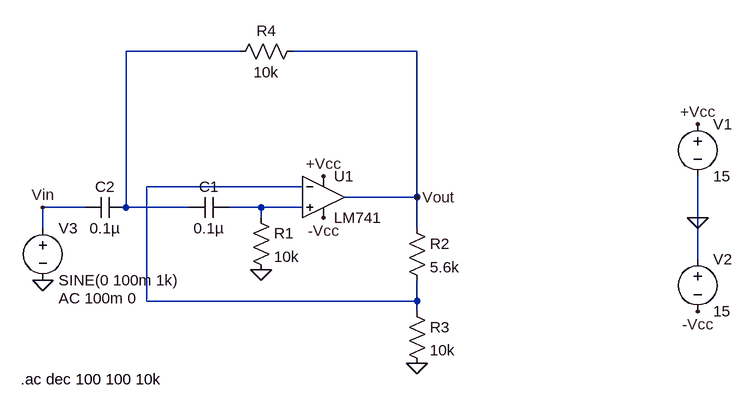
[diagram p0: schematic HPF.asc]
HPF.asc, the LTspice schematic file:
Version 4
SHEET 1 880 680
WIRE -256 -96 -432 -96
WIRE 16 -96 -176 -96
WIRE -160 112 -400 112
WIRE 16 128 16 -96
WIRE 16 128 -96 128
WIRE -496 144 -560 144
WIRE -432 144 -432 -96
WIRE -336 144 -432 144
WIRE -224 144 -272 144
WIRE -160 144 -224 144
WIRE -224 160 -224 144
WIRE 448 160 448 96
WIRE -560 176 -560 144
WIRE 16 176 16 128
WIRE 448 224 448 160
WIRE -400 288 -400 112
WIRE 16 288 16 256
WIRE 16 288 -400 288
WIRE 16 304 16 288
FLAG 448 160 0
FLAG 448 16 +Vcc
FLAG 448 304 -Vcc
FLAG -224 240 0
FLAG 16 384 0
FLAG -128 96 +Vcc
FLAG -128 160 -Vcc
FLAG 16 128 Vout
FLAG -560 256 0
FLAG -560 144 Vin
SYMBOL voltage 448 0 R0
WINDOW 123 0 0 Left 0
WINDOW 39 0 0 Left 0
SYMATTR InstName V1
SYMATTR Value 15
SYMBOL voltage 448 208 R0
WINDOW 123 0 0 Left 0
WINDOW 39 0 0 Left 0
SYMATTR InstName V2
SYMATTR Value 15
SYMBOL res 0 160 R0
SYMATTR InstName R2
SYMATTR Value 5.6k
SYMBOL res 0 288 R0
SYMATTR InstName R3
SYMATTR Value 10k
SYMBOL OpAmps\\LM741 -128 64 R0
SYMATTR InstName U1
SYMBOL res -160 -112 R90
WINDOW 0 0 56 VBottom 2
WINDOW 3 32 56 VTop 2
SYMATTR InstName R4
SYMATTR Value 10k
SYMBOL res -240 144 R0
SYMATTR InstName R1
SYMATTR Value 10k
SYMBOL cap -272 128 R90
WINDOW 0 0 32 VBottom 2
WINDOW 3 32 32 VTop 2
SYMATTR InstName C1
SYMATTR Value 0.1µ
SYMBOL cap -432 128 R90
WINDOW 0 0 32 VBottom 2
WINDOW 3 32 32 VTop 2
SYMATTR InstName C2
SYMATTR Value 0.1µ
SYMBOL voltage -560 160 R0
WINDOW 123 24 124 Left 2
WINDOW 39 0 0 Left 0
SYMATTR InstName V3
SYMATTR Value SINE(0 100m 1k)
SYMATTR Value2 AC 100m 0
TEXT -594 408 Left 2 !.ac dec 100 100 10k

The netlist it stands for:
* HPF.asc
V1 +Vcc 0 15
V2 0 -Vcc 15
R2 Vout N002 5.6k
R3 N002 0 10k
XU1 N003 N002 +Vcc -Vcc Vout LM741  ; pins In+ In- V+ V- OUT
R4 Vout N001 10k
R1 N003 0 10k
C1 N003 N001 0.1µ
C2 N001 Vin 0.1µ
V3 Vin 0 SINE(0 100m 1k) AC 100m 0
.ac dec 100 100 10k
.lib LM741.lib
.backanno
.end